# EAGLE schematic Robot_Psoc (EAGLE 7.5.0)
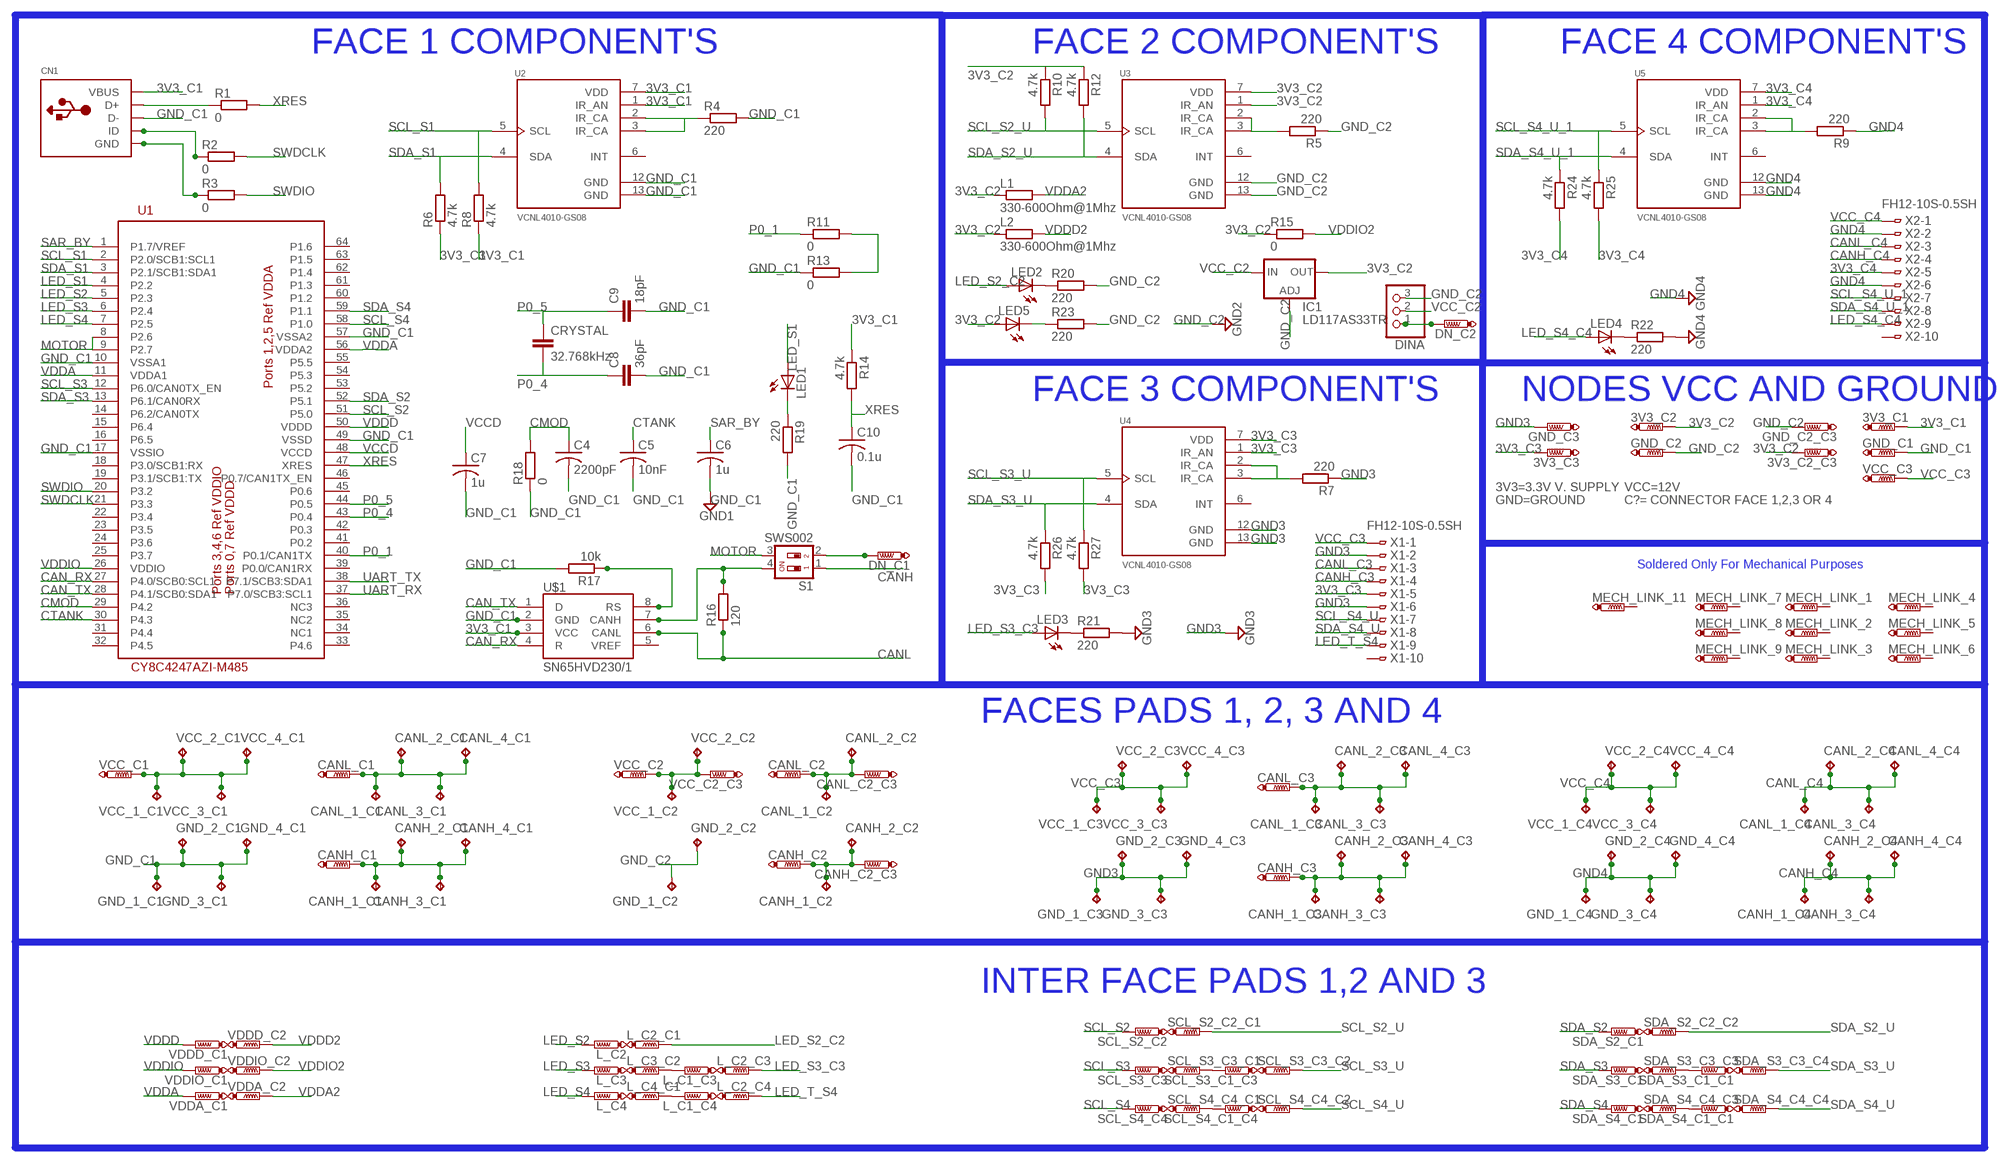
[diagram p0: schematic, sheet 1]

## Parts
3V3_C1  PTR1TP11R  [TP11R]
3V3_C2  PTR1TP11R  [TP11R]
3V3_C2_C3  PTR1TP11R  [TP11R]
3V3_C3  PTR1TP11R  [TP11R]
C4  2200pF  C-USC0805  [C0805]
C5  10nF  C-USC0805  [C0805]
C6  1u  C-USC0805  [C0805]
C7  1u  C-USC0805  [C0805]
C8  36pF  C-EUC0805  [C0805]
C9  18pF  C-EUC0805  [C0805]
C10  0.1u  C-USC0805  [C0805]
CANH_1_C1  TPB2,54  [B2,54]
CANH_1_C2  TPB2,54  [B2,54]
CANH_1_C3  TPB2,54  [B2,54]
CANH_1_C4  TPB2,54  [B2,54]
CANH_2_C1  TPB2,54  [B2,54]
CANH_2_C2  TPB2,54  [B2,54]
CANH_2_C3  TPB2,54  [B2,54]
CANH_2_C4  TPB2,54  [B2,54]
CANH_3_C1  TPB2,54  [B2,54]
CANH_3_C3  TPB2,54  [B2,54]
CANH_3_C4  TPB2,54  [B2,54]
CANH_4_C1  TPB2,54  [B2,54]
CANH_4_C3  TPB2,54  [B2,54]
CANH_4_C4  TPB2,54  [B2,54]
CANH_C1  PTR1TP11R  [TP11R]
CANH_C2  PTR1TP11R  [TP11R]
CANH_C2_C3  PTR1TP11R  [TP11R]
CANH_C3  PTR1TP11R  [TP11R]
CANL_1_C1  TPB2,54  [B2,54]
CANL_1_C2  TPB2,54  [B2,54]
CANL_1_C3  TPB2,54  [B2,54]
CANL_1_C4  TPB2,54  [B2,54]
CANL_2_C1  TPB2,54  [B2,54]
CANL_2_C2  TPB2,54  [B2,54]
CANL_2_C3  TPB2,54  [B2,54]
CANL_2_C4  TPB2,54  [B2,54]
CANL_3_C1  TPB2,54  [B2,54]
CANL_3_C3  TPB2,54  [B2,54]
CANL_3_C4  TPB2,54  [B2,54]
CANL_4_C1  TPB2,54  [B2,54]
CANL_4_C3  TPB2,54  [B2,54]
CANL_4_C4  TPB2,54  [B2,54]
CANL_C1  PTR1TP11R  [TP11R]
CANL_C2  PTR1TP11R  [TP11R]
CANL_C2_C3  PTR1TP11R  [TP11R]
CANL_C3  PTR1TP11R  [TP11R]
CN1  USBMINIB  [USB-MINIB]
CRYSTAL  32.768kHz  C-EUC0603  [C0603]
DINA  PINHD-1X3  [1X03]
DN_C1  PTR1TP11R  [TP11R]
DN_C2  PTR1TP11R  [TP11R]
GND_1_C1  TPB2,54  [B2,54]
GND_1_C2  TPB2,54  [B2,54]
GND_1_C3  TPB2,54  [B2,54]
GND_1_C4  TPB2,54  [B2,54]
GND_2_C1  TPB2,54  [B2,54]
GND_2_C2  TPB2,54  [B2,54]
GND_2_C3  TPB2,54  [B2,54]
GND_2_C4  TPB2,54  [B2,54]
GND_3_C1  TPB2,54  [B2,54]
GND_3_C3  TPB2,54  [B2,54]
GND_3_C4  TPB2,54  [B2,54]
GND_4_C1  TPB2,54  [B2,54]
GND_4_C3  TPB2,54  [B2,54]
GND_4_C4  TPB2,54  [B2,54]
GND_C1  PTR1TP11R  [TP11R]
GND_C2  PTR1TP11R  [TP11R]
GND_C2_C3  PTR1TP11R  [TP11R]
GND_C3  PTR1TP11R  [TP11R]
IC1  LD117AS33TR  [SOT223]
L1  330-600Ohm@1Mhz  R-EU_R0805  [R0805]
L2  330-600Ohm@1Mhz  R-EU_R0805  [R0805]
L_C1_C3  PTR1TP11R  [TP11R]
L_C1_C4  PTR1TP11R  [TP11R]
L_C2  PTR1TP11R  [TP11R]
L_C2_C1  PTR1TP11R  [TP11R]
L_C2_C3  PTR1TP11R  [TP11R]
L_C2_C4  PTR1TP11R  [TP11R]
L_C3  PTR1TP11R  [TP11R]
L_C3_C2  PTR1TP11R  [TP11R]
L_C4  PTR1TP11R  [TP11R]
L_C4_C1  PTR1TP11R  [TP11R]
LED1  LEDCHIPLED_0805  [CHIPLED_0805]
LED2  LEDCHIPLED_0805  [CHIPLED_0805]
LED3  LEDCHIPLED_0805  [CHIPLED_0805]
LED4  LEDCHIPLED_0805  [CHIPLED_0805]
LED5  LEDCHIPLED_0805  [CHIPLED_0805]
MECH_LINK_1  PTR1TP11R  [TP11R]
MECH_LINK_2  PTR1TP11R  [TP11R]
MECH_LINK_3  PTR1TP11R  [TP11R]
MECH_LINK_4  PTR1TP11R  [TP11R]
MECH_LINK_5  PTR1TP11R  [TP11R]
MECH_LINK_6  PTR1TP11R  [TP11R]
MECH_LINK_7  PTR1TP11R  [TP11R]
MECH_LINK_8  PTR1TP11R  [TP11R]
MECH_LINK_9  PTR1TP11R  [TP11R]
MECH_LINK_11  PTR1TP11R  [TP11R]
R1  0  R-EU_R0805  [R0805]
R2  0  R-EU_R0805  [R0805]
R3  0  R-EU_R0805  [R0805]
R4  220  R-EU_R0805  [R0805]
R5  220  R-EU_R0805  [R0805]
R6  4.7k  R-EU_R0805  [R0805]
R7  220  R-EU_R0805  [R0805]
R8  4.7k  R-EU_R0805  [R0805]
R9  220  R-EU_R0805  [R0805]
R10  4.7k  R-EU_R0805  [R0805]
R11  0  R-EU_R0805  [R0805]
R12  4.7k  R-EU_R0805  [R0805]
R13  0  R-EU_R0805  [R0805]
R14  4.7k  R-EU_R0805  [R0805]
R15  0  R-EU_R0805  [R0805]
R16  120  R-EU_R0805  [R0805]
R17  10k  R-EU_R0805  [R0805]
R18  0  R-EU_R0805  [R0805]
R19  220  R-EU_R0805  [R0805]
R20  220  R-EU_R0805  [R0805]
R21  220  R-EU_R0805  [R0805]
R22  220  R-EU_R0805  [R0805]
R23  220  R-EU_R0805  [R0805]
R24  4.7k  R-EU_R0805  [R0805]
R25  4.7k  R-EU_R0805  [R0805]
R26  4.7k  R-EU_R0805  [R0805]
R27  4.7k  R-EU_R0805  [R0805]
S1  SWS002  [SMS-002]
SCL_S2_C2  PTR1TP11R  [TP11R]
SCL_S2_C2_C1  PTR1TP11R  [TP11R]
SCL_S3_C1_C3  PTR1TP11R  [TP11R]
SCL_S3_C3  PTR1TP11R  [TP11R]
SCL_S3_C3_C1  PTR1TP11R  [TP11R]
SCL_S3_C3_C2  PTR1TP11R  [TP11R]
SCL_S4_C1_C4  PTR1TP11R  [TP11R]
SCL_S4_C4  PTR1TP11R  [TP11R]
SCL_S4_C4_C1  PTR1TP11R  [TP11R]
SCL_S4_C4_C2  PTR1TP11R  [TP11R]
SDA_S2_C1  PTR1TP11R  [TP11R]
SDA_S2_C2_C2  PTR1TP11R  [TP11R]
SDA_S3_C1  PTR1TP11R  [TP11R]
SDA_S3_C1_C1  PTR1TP11R  [TP11R]
SDA_S3_C3_C3  PTR1TP11R  [TP11R]
SDA_S3_C3_C4  PTR1TP11R  [TP11R]
SDA_S4_C1  PTR1TP11R  [TP11R]
SDA_S4_C1_C1  PTR1TP11R  [TP11R]
SDA_S4_C4_C3  PTR1TP11R  [TP11R]
SDA_S4_C4_C4  PTR1TP11R  [TP11R]
U1  CY8C4247AZI-M485  [TQFP64-10X10]
U2  VCNL4010-GS08  [XDCR_VCNL4010-GS08]
U3  VCNL4010-GS08  [XDCR_VCNL4010-GS08]
U4  VCNL4010-GS08  [XDCR_VCNL4010-GS08]
U5  VCNL4010-GS08  [XDCR_VCNL4010-GS08]
U$1  SN65HVD230/1  [SO8]
VCC_1_C1  TPB2,54  [B2,54]
VCC_1_C2  TPB2,54  [B2,54]
VCC_1_C3  TPB2,54  [B2,54]
VCC_1_C4  TPB2,54  [B2,54]
VCC_2_C1  TPB2,54  [B2,54]
VCC_2_C2  TPB2,54  [B2,54]
VCC_2_C3  TPB2,54  [B2,54]
VCC_2_C4  TPB2,54  [B2,54]
VCC_3_C1  TPB2,54  [B2,54]
VCC_3_C3  TPB2,54  [B2,54]
VCC_3_C4  TPB2,54  [B2,54]
VCC_4_C1  TPB2,54  [B2,54]
VCC_4_C3  TPB2,54  [B2,54]
VCC_4_C4  TPB2,54  [B2,54]
VCC_C1  PTR1TP11R  [TP11R]
VCC_C2  PTR1TP11R  [TP11R]
VCC_C2_C3  PTR1TP11R  [TP11R]
VCC_C3  PTR1TP11R  [TP11R]
VDDA_C1  PTR1TP11R  [TP11R]
VDDA_C2  PTR1TP11R  [TP11R]
VDDD_C1  PTR1TP11R  [TP11R]
VDDD_C2  PTR1TP11R  [TP11R]
VDDIO_C1  PTR1TP11R  [TP11R]
VDDIO_C2  PTR1TP11R  [TP11R]
X1  FH12-10S-0.5SH  [FH12-10S-0.5SH]
X2  FH12-10S-0.5SH  [FH12-10S-0.5SH]

## Nets
3V3_C1: 3V3_C1.TP CN1.VBUS R6.1 R8.1 R14.1 U2.1(IR_AN) U2.7(VDD) U$1.3(VCC)
3V3_C2: 3V3_C2.TP 3V3_C2_C3.TP IC1.4(OUT) L1.1 L2.1 LED5.A R10.1 R12.1 R15.1 U3.1(IR_AN) U3.7(VDD)
3V3_C3: 3V3_C3.TP R26.2 R27.2 U4.1(IR_AN) U4.7(VDD) X1.5
3V3_C4: R24.2 R25.2 U5.1(IR_AN) U5.7(VDD) X2.5
CAN_RX: U1.27(P4.0/SCB0:SCL1) U$1.4(R)
CAN_TX: U1.28(P4.1/SCB0:SDA1) U$1.1(D)
CANH: CANH_1_C1.TP CANH_2_C1.TP CANH_3_C1.TP CANH_4_C1.TP CANH_C1.TP S1.1
CANH_C3: CANH_1_C3.TP CANH_2_C3.TP CANH_3_C3.TP CANH_4_C3.TP CANH_C3.TP X1.4
CANH_C4: CANH_1_C4.TP CANH_2_C4.TP CANH_3_C4.TP CANH_4_C4.TP X2.4
CANL: CANL_1_C1.TP CANL_2_C1.TP CANL_3_C1.TP CANL_4_C1.TP CANL_C1.TP R16.1 U$1.6(CANL)
CANL_C3: CANL_1_C3.TP CANL_2_C3.TP CANL_3_C3.TP CANL_4_C3.TP CANL_C3.TP X1.3
CANL_C4: CANL_1_C4.TP CANL_2_C4.TP CANL_3_C4.TP CANL_4_C4.TP X2.3
CMOD: C4.1 R18.2 U1.29(P4.2)
CTANK: C5.1 U1.30(P4.3)
GND3: GND_1_C3.TP GND_2_C3.TP GND_3_C3.TP GND_4_C3.TP GND_C3.TP R7.1 R21.2 U4.12(GND) U4.13(GND) X1.2 X1.6
GND4: GND_1_C4.TP GND_2_C4.TP GND_3_C4.TP GND_4_C4.TP R9.1 R22.2 U5.12(GND) U5.13(GND) X2.2 X2.6
GND_C1: C4.2 C5.2 C6.2 C7.2 C8.2 C9.2 C10.2 CN1.D- GND_1_C1.TP GND_2_C1.TP GND_3_C1.TP GND_4_C1.TP GND_C1.TP R4.2 R13.1 R17.2 R18.1 R19.2 U1.10(VSSA1) U1.17(VSSIO) U1.49(VSSD) U1.57(VSSA2) U2.12(GND) U2.13(GND) U$1.2(GND) ; supply symbol labelled GND1
GND_C2: DINA.3 GND_1_C2.TP GND_2_C2.TP GND_C2.TP GND_C2_C3.TP IC1.1(ADJ) R5.1 R20.2 R23.2 U3.12(GND) U3.13(GND) ; supply symbol labelled GND2
LED_S1: LED1.A U1.4(P2.2)
LED_S2: L_C2.TP U1.5(P2.3)
LED_S2_C2: L_C2_C1.TP LED2.A
LED_S3: L_C3.TP U1.6(P2.4)
LED_S3_C3: L_C2_C3.TP LED3.A
LED_S4: L_C4.TP U1.7(P2.5)
LED_S4_C4: LED4.A X2.9
LED_T_S4: L_C2_C4.TP X1.9
MOTOR: S1.3 U1.8(P2.6) U1.9(P2.7)
N$1: CN1.D+ R1.1
N$2: CN1.ID R2.1
N$3: CN1.GND R3.1
N$4: R11.2 R13.2
N$5: R16.2 S1.4 U$1.7(CANH)
N$7: CANH_1_C2.TP CANH_2_C2.TP CANH_C2.TP CANH_C2_C3.TP
N$8: R7.2 U4.2(IR_CA) U4.3(IR_CA)
N$9: R17.1 U$1.8(RS)
N$10: SDA_S3_C1_C1.TP SDA_S3_C3_C3.TP
N$13: DN_C1.TP S1.2
N$14: LED1.C R19.1
N$15: LED2.C R20.1
N$16: LED3.C R21.1
N$17: LED4.C R22.1
N$18: LED5.C R23.1
N$19: DINA.1 DN_C2.TP
N$20: L_C1_C4.TP L_C4_C1.TP
N$21: R4.1 U2.2(IR_CA) U2.3(IR_CA)
N$22: L_C1_C3.TP L_C3_C2.TP
N$26: SCL_S3_C1_C3.TP SCL_S3_C3_C1.TP
N$27: SCL_S4_C1_C4.TP SCL_S4_C4_C1.TP
N$29: VCC_1_C1.TP VCC_2_C1.TP VCC_3_C1.TP VCC_4_C1.TP VCC_C1.TP
N$32: CANL_1_C2.TP CANL_2_C2.TP CANL_C2.TP CANL_C2_C3.TP
N$43: R5.2 U3.2(IR_CA) U3.3(IR_CA)
N$44: SDA_S4_C1_C1.TP SDA_S4_C4_C3.TP
N$46: R9.2 U5.2(IR_CA) U5.3(IR_CA)
P0_1: R11.1 U1.40(P0.1/CAN1TX)
P0_4: C8.1 CRYSTAL.2 U1.43(P0.4)
P0_5: C9.1 CRYSTAL.1 U1.44(P0.5)
SAR_BY: C6.1 U1.1(P1.7/VREF)
SCL_S1: R8.2 U1.2(P2.0/SCB1:SCL1) U2.5(SCL)
SCL_S2: SCL_S2_C2.TP U1.51(P5.0)
SCL_S2_U: R10.2 SCL_S2_C2_C1.TP U3.5(SCL)
SCL_S3: SCL_S3_C3.TP U1.12(P6.0/CAN0TX_EN)
SCL_S3_U: R27.1 SCL_S3_C3_C2.TP U4.5(SCL)
SCL_S4: SCL_S4_C4.TP U1.58(P1.0)
SCL_S4_U: SCL_S4_C4_C2.TP X1.7
SCL_S4_U_1: R25.1 U5.5(SCL) X2.7
SDA_S1: R6.2 U1.3(P2.1/SCB1:SDA1) U2.4(SDA)
SDA_S2: SDA_S2_C1.TP U1.52(P5.1)
SDA_S2_U: R12.2 SDA_S2_C2_C2.TP U3.4(SDA)
SDA_S3: SDA_S3_C1.TP U1.13(P6.1/CAN0RX)
SDA_S3_U: R26.1 SDA_S3_C3_C4.TP U4.4(SDA)
SDA_S4: SDA_S4_C1.TP U1.59(P1.1)
SDA_S4_U: SDA_S4_C4_C4.TP X1.8
SDA_S4_U_1: R24.1 U5.4(SDA) X2.8
SWDCLK: R2.2 U1.21(P3.3)
SWDIO: R3.2 U1.20(P3.2)
UART_RX: U1.37(P7.0/SCB3:SCL1)
UART_TX: U1.38(P7.1/SCB3:SDA1)
VCC_C2: DINA.2 IC1.3(IN) VCC_1_C2.TP VCC_2_C2.TP VCC_C2.TP VCC_C2_C3.TP
VCC_C3: VCC_1_C3.TP VCC_2_C3.TP VCC_3_C3.TP VCC_4_C3.TP VCC_C3.TP X1.1
VCC_C4: VCC_1_C4.TP VCC_2_C4.TP VCC_3_C4.TP VCC_4_C4.TP X2.1
VCCD: C7.1 U1.48(VCCD)
VDDA: U1.11(VDDA1) U1.56(VDDA2) VDDA_C1.TP
VDDA2: L1.2 VDDA_C2.TP
VDDD: U1.50(VDDD) VDDD_C1.TP
VDDD2: L2.2 VDDD_C2.TP
VDDIO: U1.26(VDDIO) VDDIO_C1.TP
VDDIO2: R15.2 VDDIO_C2.TP
XRES: C10.1 R1.2 R14.2 U1.47(XRES)
Unconnected: MECH_LINK_1.TP MECH_LINK_2.TP MECH_LINK_3.TP MECH_LINK_4.TP MECH_LINK_5.TP MECH_LINK_6.TP MECH_LINK_7.TP MECH_LINK_8.TP MECH_LINK_9.TP MECH_LINK_11.TP U1.14(P6.2/CAN0TX) U1.15(P6.4) U1.16(P6.5) U1.18(P3.0/SCB1:RX) U1.19(P3.1/SCB1:TX) U1.22(P3.4) U1.23(P3.5) U1.24(P3.6) U1.25(P3.7) U1.31(P4.4) U1.32(P4.5) U1.33(P4.6) U1.34(NC1) U1.35(NC2) U1.36(NC3) U1.39(P0.0/CAN1RX) U1.41(P0.2) U1.42(P0.3) U1.45(P0.6) U1.46(P0.7/CAN1TX_EN) U1.53(P5.2) U1.54(P5.3) U1.55(P5.5) U1.60(P1.2) U1.61(P1.3) U1.62(P1.4) U1.63(P1.5) U1.64(P1.6) U2.6(INT) U3.6(INT) U4.6(INT) U5.6(INT) U$1.5(VREF) X1.10 X2.10

## Notes on the sheet
- FACE 1 COMPONENT'S | FACE 2 COMPONENT'S | FACE 4 COMPONENT'S
- FACE 3 COMPONENT'S | NODES VCC AND GROUND
- 3V3=3.3V V. SUPPLY | VCC=12V
- GND=GROUND | C?= CONNECTOR FACE 1,2,3 OR 4
- Soldered Only For Mechanical Purposes
- FACES PADS 1, 2, 3 AND 4
- INTER FACE PADS 1,2 AND 3

## Library data of the parts
3V3_C1 3V3_C2 3V3_C2_C3 3V3_C3 CANH_C1 CANH_C2 CANH_C2_C3 CANH_C3 CANL_C1 CANL_C2 CANL_C2_C3 CANL_C3 DN_C1 DN_C2 GND_C1 GND_C2 GND_C2_C3 GND_C3 L_C1_C3 L_C1_C4 L_C2 L_C2_C1 L_C2_C3 L_C2_C4 L_C3 L_C3_C2 L_C4 L_C4_C1 MECH_LINK_1-MECH_LINK_9 MECH_LINK_11 SCL_S2_C2 SCL_S2_C2_C1 SCL_S3_C1_C3 SCL_S3_C3 SCL_S3_C3_C1 SCL_S3_C3_C2 SCL_S4_C1_C4 SCL_S4_C4 SCL_S4_C4_C1 SCL_S4_C4_C2 SDA_S2_C1 SDA_S2_C2_C2 SDA_S3_C1 SDA_S3_C1_C1 SDA_S3_C3_C3 SDA_S3_C3_C4 SDA_S4_C1 SDA_S4_C1_C1 SDA_S4_C4_C3 SDA_S4_C4_C4 VCC_C1 VCC_C2 VCC_C2_C3 VCC_C3 VDDA_C1 VDDA_C2 VDDD_C1 VDDD_C2 VDDIO_C1 VDDIO_C2 = testpad:PTR1: TEST PIN
C4-C7 C10 = rcl:C-US: CAPACITOR, American symbol
C8 C9 CRYSTAL = rcl:C-EU: CAPACITOR, European symbol
CANH_1_C1-CANH_1_C4 CANH_2_C1-CANH_2_C4 CANH_3_C1 CANH_3_C3 CANH_3_C4 CANH_4_C1 CANH_4_C3 CANH_4_C4 CANL_1_C1-CANL_1_C4 CANL_2_C1-CANL_2_C4 CANL_3_C1 CANL_3_C3 CANL_3_C4 CANL_4_C1 CANL_4_C3 CANL_4_C4 GND_1_C1-GND_1_C4 GND_2_C1-GND_2_C4 GND_3_C1 GND_3_C3 GND_3_C4 GND_4_C1 GND_4_C3 GND_4_C4 VCC_1_C1-VCC_1_C4 VCC_2_C1-VCC_2_C4 VCC_3_C1 VCC_3_C3 VCC_3_C4 VCC_4_C1 VCC_4_C3 VCC_4_C4 = testpad:TP: Test pad
CN1 = adafruit:USB: USB Connectors USBMINIB - Surface Mount Female Mini-B USB Connector 4UConnector: 06564 By microbuilder.eu Thru-hole RA Female Mini-B USB Connector 4UConnector: 18732 By ladyada.net
DINA = pinhead:PINHD-1X3: PIN HEADER
IC1 = v-reg:LD117A?*: Low drop fixed and adjustable positive voltage regulators 1 A Source: http://www.st.com/stonline/products/literature/ds/7194/ld1117axx.pdf
L1 L2 R1-R27 = rcl:R-EU_: RESISTOR, European symbol
LED1-LED5 = adafruit:LED: LED OSRAM: - CHIPLED LG R971, LG N971, LY N971, LG Q971, LY Q971, LO R971, LY R971 LH N974, LH R974 LS Q976, LO Q976, LY Q976 LO Q996 - Hyper CHIPLED LW Q18S LB Q993, LB Q99A, LB R99A - SideLED LS A670, LO A670, LY A670, LG A670, LP A670 LB A673, LV A673, LT A673, LW A673 LH A674 LY A675 LS A676, LA A676, LO A676, LY A676, LW A676 LS A679, LY A679, LG A679 - Hyper Micro SIDELED® LS Y876, LA Y876, LO Y876, LY Y876 LT Y87S - SmartLED LW L88C, LW L88S LB L89C, LB L89S, LG L890 LS L89K, LO L89K, LY L89K LS L896, LA L896, LO L896, LY L896 - TOPLED LS T670, LO T670, LY T670, LG T670, LP T670 LSG T670, LSP T670, LSY T670, LOP T670, LYG T670 LG T671, LOG T671, LSG T671 LB T673, LV T673, LT T673, LW T673 LH T674 LS T676, LA T676, LO T676, LY T676, LB T676, LH T676, LSB T676, LW T676 LB T67C, LV T67C, LT T67C, LS T67K, LO T67K, LY T67K, LW E67C LS E67B, LA E67B, LO E67B, LY E67B, LB E67C, LV E67C, LT E67C LW T67C LS T679, LY T679, LG T679 LS T770, LO T770, LY T770, LG T770, LP T770 LB T773, LV T773, LT T773, LW T773 LH T774 LS E675, LA E675, LY E675, LS T675 LS T776, LA T776, LO T776, LY T776, LB T776 LHGB T686 LT T68C, LB T68C - Hyper Mini TOPLED® LB M676 - Mini TOPLED Santana® LG M470 LS M47K, LO M47K, LY M47K Source: http://www.osram.convergy.de/
S1 = smd-special:SWS002: SMD Dip Switch 2 pol.
U1 = CypressPSoC:CY8C4247AZI-M485
U2-U5 = VCNL4010-GS08:VCNL4010-GS08
U$1 = texas_instruments:SN65HVD230/1
X1 X2 = con-hirose2:FH12-10S-0.5S: 0.5mm Pitch Connectors For FPC/FFC Source: Data sheet <http://www.hirose.co.jp/cataloge_hp/e58605370.pdf>; MPN: FH12-10S-0.5SH(55); OC_FARNELL: 1324540; OC_NEWARK: 34M6152